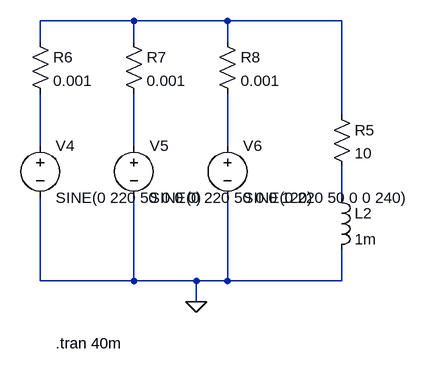
[diagram p0: schematic 3phaseRLload.asc]
3phaseRLload.asc, the LTspice schematic file:
Version 4
SHEET 1 880 680
WIRE 48 -1296 -96 -1296
WIRE 192 -1296 48 -1296
WIRE 368 -1296 192 -1296
WIRE -96 -1264 -96 -1296
WIRE 48 -1264 48 -1296
WIRE 192 -1264 192 -1296
WIRE 368 -1152 368 -1296
WIRE -96 -1104 -96 -1184
WIRE 48 -1104 48 -1184
WIRE 192 -1104 192 -1184
WIRE 368 -1024 368 -1072
WIRE -96 -896 -96 -1024
WIRE 48 -896 48 -1024
WIRE 48 -896 -96 -896
WIRE 144 -896 48 -896
WIRE 192 -896 192 -1024
WIRE 192 -896 144 -896
WIRE 368 -896 368 -944
WIRE 368 -896 192 -896
WIRE 144 -864 144 -896
FLAG 144 -864 0
SYMBOL voltage -96 -1120 R0
SYMATTR InstName V4
SYMATTR Value SINE(0 220 50 0 0 0)
SYMBOL voltage 48 -1120 R0
SYMATTR InstName V5
SYMATTR Value SINE(0 220 50 0 0 120)
SYMBOL voltage 192 -1120 R0
SYMATTR InstName V6
SYMATTR Value SINE(0 220 50 0 0 240)
SYMBOL res 352 -1168 R0
SYMATTR InstName R5
SYMATTR Value 10
SYMBOL res -112 -1280 R0
SYMATTR InstName R6
SYMATTR Value 0.001
SYMBOL res 32 -1280 R0
SYMATTR InstName R7
SYMATTR Value 0.001
SYMBOL res 176 -1280 R0
SYMATTR InstName R8
SYMATTR Value 0.001
SYMBOL ind 352 -1040 R0
SYMATTR InstName L2
SYMATTR Value 1m
TEXT -72 -800 Left 2 !.tran 40m

The netlist it stands for:
* 3phaseRLload.asc
V4 N002 0 SINE(0 220 50 0 0 0)
V5 N003 0 SINE(0 220 50 0 0 120)
V6 N004 0 SINE(0 220 50 0 0 240)
R5 N001 N005 10
R6 N001 N002 0.001
R7 N001 N003 0.001
R8 N001 N004 0.001
L2 N005 0 1m
.tran 40m
.backanno
.end